# EAGLE design Keg Cop - Meter Breakout (EAGLE 9.6.2)
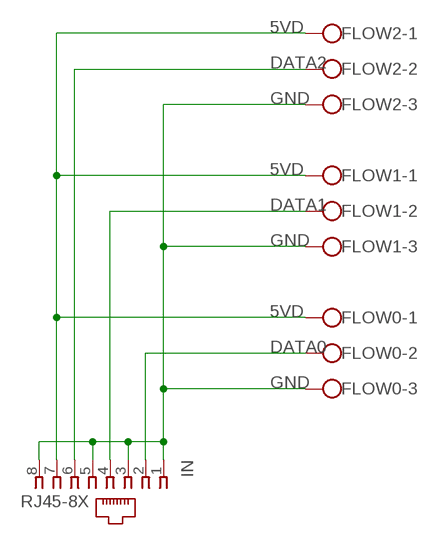
[diagram p0: schematic, sheet 1]

## Parts
FLOW0  W237-103  [W237-103]
FLOW1  W237-103  [W237-103]
FLOW2  W237-103  [W237-103]
IN  RJ45-8X  [RJ45-NO-SHIELD]

## Nets
5VD: FLOW0.1 FLOW1.1 FLOW2.1 IN.7
DATA0: FLOW0.2 IN.2
DATA1: FLOW1.2 IN.4
DATA2: FLOW2.2 IN.6
GND [GND]: FLOW0.3 FLOW1.3 FLOW2.3 IN.1 IN.3 IN.5 IN.8

## Library data of the parts
FLOW0 FLOW1 FLOW2 = con-wago-500:W237-103: WAGO SCREW CLAMP; MPN: 237-103; OC_FARNELL: unknown; OC_NEWARK: 18M7116
IN = con-tycoelectronics:RJ45: CORCOM Modular RJ Jacks No Shield Source: www.tycoelectronics.com .. ENG_DS_1654001_1099_RJ_L_0507.pdf; MPN: RJ45-8X; OC_FARNELL: unknown; OC_NEWARK: 16R6101

## Board
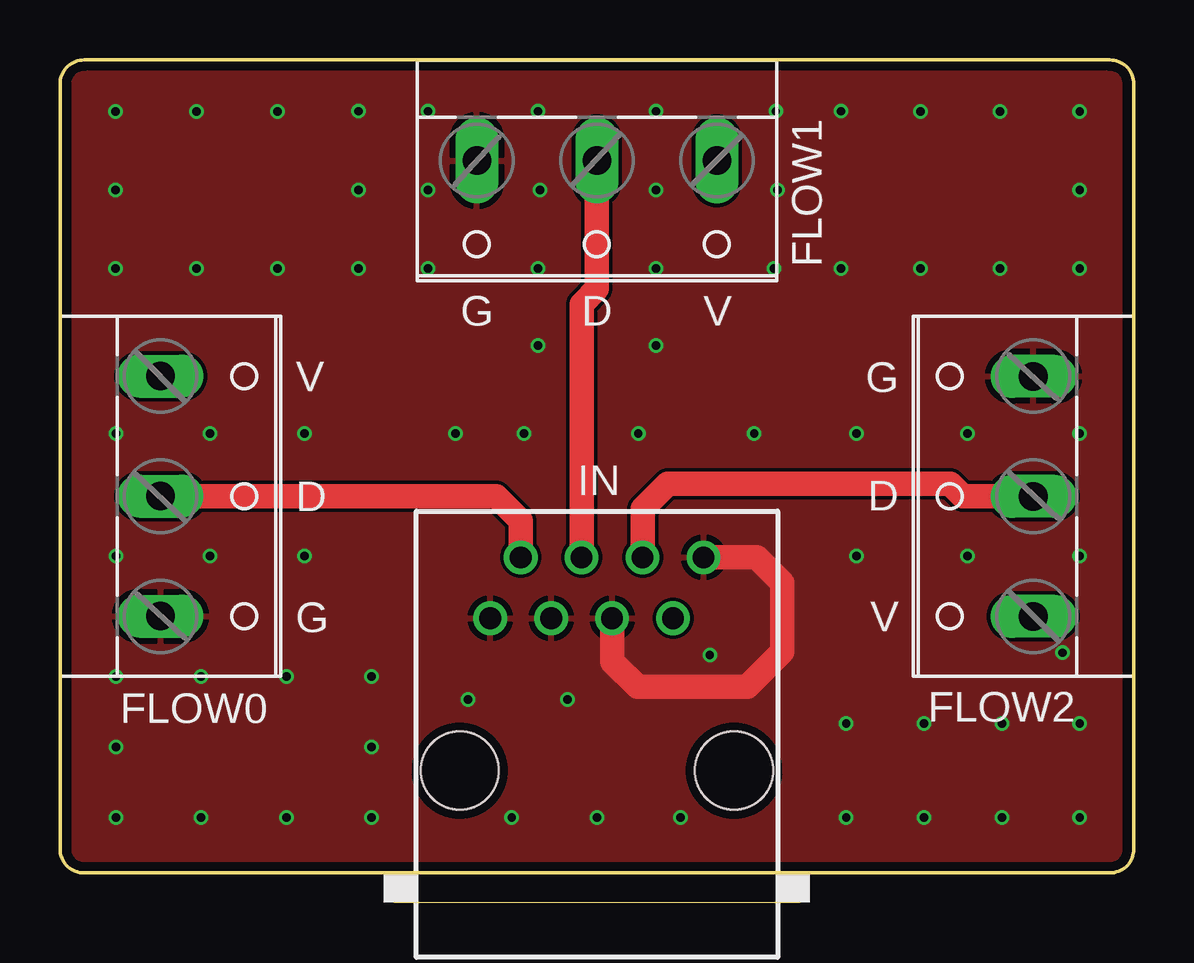
[diagram p1: board, top side]
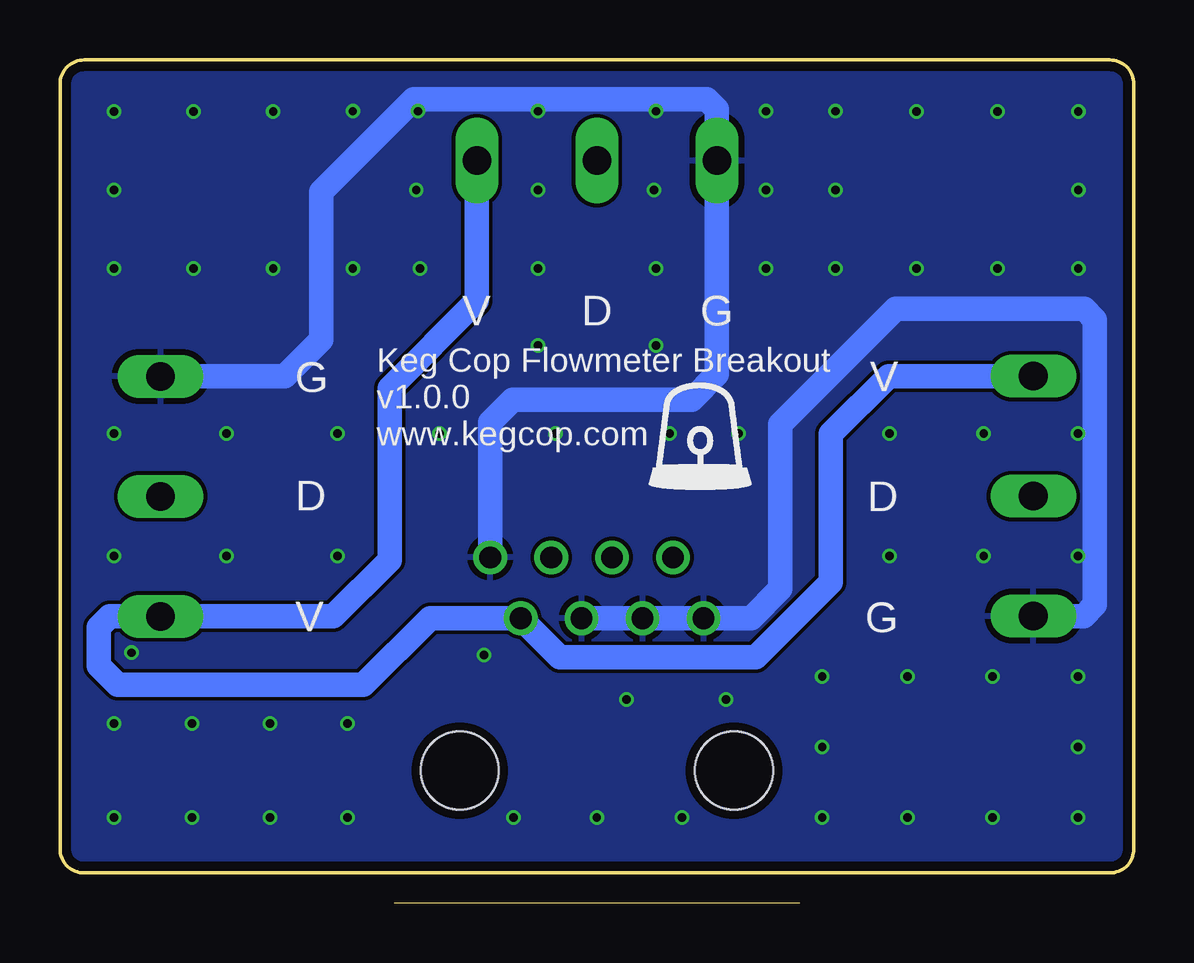
[diagram p2: board, bottom side, seen from below]

Size 44.74 x 33.87 mm. Coordinates in mm from the lower left corner, seen from the top.
Outline: 0,32.87 0,1 arc90 1,0 43.74,0 arc90 44.74,1 44.74,32.87 arc90 43.74,33.87 1,33.87 arc90 0,32.87
Copper layers (1*16): Top 0.035559375mm / dielectric 1.6mm / Bottom 0.035559375mm
Design rules "oshpark-2layer *": minimum track width 6mil, minimum drill 10mil, track to track 6mil, track to pad 6mil, pad to pad 6mil, via to via 6mil, smd to smd 6mil, copper to edge 15mil, drill to drill 6mil, minimum pad ring 5mil, minimum via ring 5mil, stop-mask expansion 2.5mil, vias tented up to drill 35mil, thermal gap 10mil

### Footprints (pad centres in the part's own frame; a part is rotated, then mirrored left to right if it is on the bottom)
W237-103 = drill 1.194 long: 1 -5,-1.29; 2 0,-1.29; 3 5,-1.29
RJ45-NO-SHIELD = drill 0.9 pad 1.4: 1 -4.445,6.35; 2 -3.175,8.89; 3 -1.905,6.35; 4 -0.635,8.89; 5 0.635,6.35; 6 1.905,8.89; 7 3.175,6.35; 8 4.445,8.89 | hole 3.251: -5.715,0; 5.715,0

### Placement (x,y rotation side)
FLOW0  5.48,15.7 270 top
FLOW1  22.37,28.39 180 top
FLOW2  39.26,15.69 90 top
IN  22.37,4.26 0 top

### Tracks (layer width: path | path; a pad name or v marks a point on that pad's centre or on a via)
5VD
  Bottom 1.016: FLOW0.1 10.22,20.7 12.62,18.3 12.62,12.12 15.75,8.99 23.93,8.99 IN.7 29.33,10.61 32.11,7.83 42.35,7.83 43.14,8.62 43.14,10.23 42.68,10.69 FLOW2.1 33.35,10.69 31.01,13.03 31.01,20.2 27.37,23.84 FLOW1.1
DATA0
  Top 1.016: FLOW0.2 18.18,15.7 19.2,14.68 IN.2
DATA1
  Top 1.016: IN.4 21.74,23.7 22.37,24.34 FLOW1.2
DATA2
  Top 1.016: IN.6 24.28,15.17 25.32,16.22 37.09,16.22 37.61,15.69 FLOW2.2
GND  (via drill 0.35)
  Top 1.016: IN.5 23.01,8.81 24.06,7.75 28.64,7.75 30.1,9.21 30.1,12.08 29.03,13.15 IN.8
  Bottom 1.016: IN.8 26.82,18.77 25.87,19.71 18.43,19.71 17.37,20.77 FLOW1.3 17.37,31.82 17.8,32.24 30,32.24 33.85,28.39 33.85,22.21 35.38,20.69 FLOW2.3 | IN.5 IN.3 IN.1 15.95,10.61 14.73,11.83 14.73,18.69 9.92,23.5 2.08,23.5 1.62,23.04 1.62,11.17 2.09,10.7 FLOW0.3
  other vias: 2.33,8.19 2.33,2.3 5.88,2.3 12.98,2.3 32.76,2.3 36,2.3 42.49,2.3 41.76,9.17 42.49,25.18 42.49,31.72 35.86,31.72 32.54,31.74 12.44,31.74 2.32,31.72 2.32,25.18 5.69,31.72 9.06,31.72 2.32,28.45 12.44,28.45 5.69,25.18 9.06,25.18 12.44,25.18 19.99,28.45 24.83,28.45 24.83,25.18 19.92,25.18 19.92,21.98 24.83,21.98 29.9,28.45 29.74,25.18 32.54,25.18 39.17,31.72 42.49,28.45 39.17,25.18 35.86,25.18 16.47,18.3 24.09,18.3 28.93,18.3 33.18,18.3 37.81,18.3 42.49,18.3 32.76,6.23 36,6.23 39.25,6.23 42.49,6.23 39.25,2.3 25.85,2.3 22.38,2.3 18.82,2.3 12.98,5.24 2.33,5.24 5.88,8.19 9.43,8.19 12.98,8.19 2.33,18.3 2.33,13.21 6.26,18.3 6.26,13.21 10.18,18.3 10.18,13.21 9.43,2.3 17,7.22 21.15,7.22 27.07,9.08 33.18,13.21 37.81,13.21 42.49,13.21 19.92,31.74 15.33,31.74 15.33,28.45 15.33,25.18 24.83,31.74 29.82,31.74 19.34,18.3
  pour Top: -0.15,-0.07 -0.15,-0.06 -0.15,34.08 44.85,34.08 44.85,-0.07
  pour Bottom: 44.86,-0.07 -0.16,-0.07 -0.16,34.08 44.86,34.08

### Text on the board
tNames: G | D | V | V | G | D | D | G | V
bNames: G | D | V | V | G | Keg Cop Flowmeter Breakout / v1.0.0 / www.kegcop.com | D | D | G | V